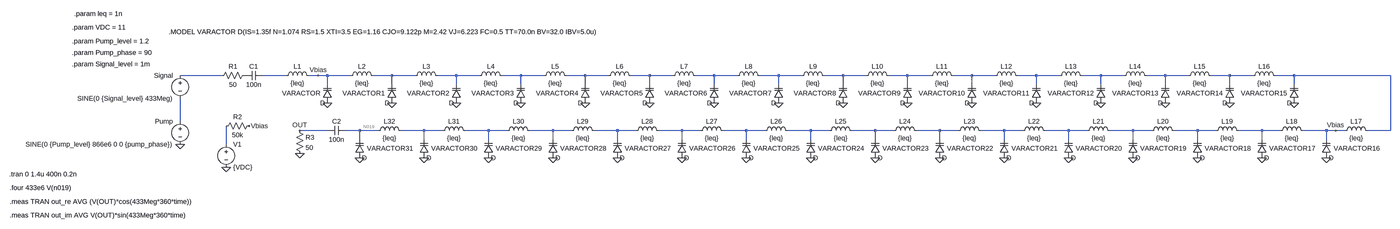
[diagram p0: schematic Parametric_amplifier_first_iteration(probaly not working properly).asc, whole sheet]
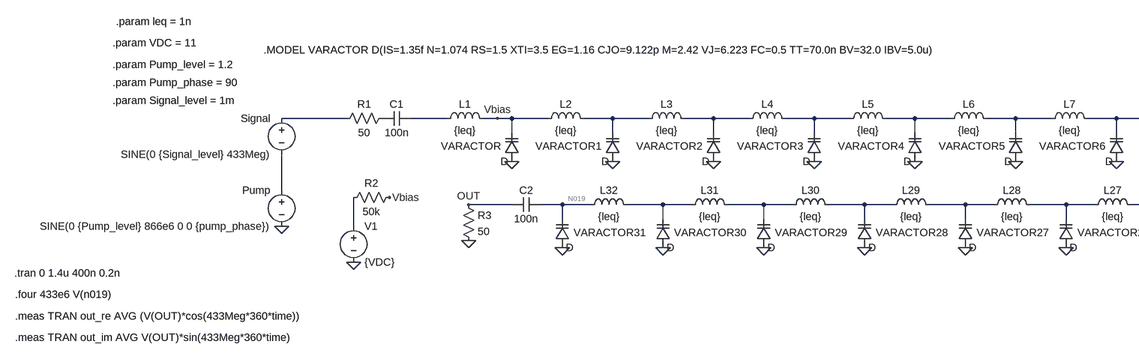
[diagram p1: schematic Parametric_amplifier_first_iteration(probaly not working properly).asc, part, row 1 of 1, column 1 of 2]
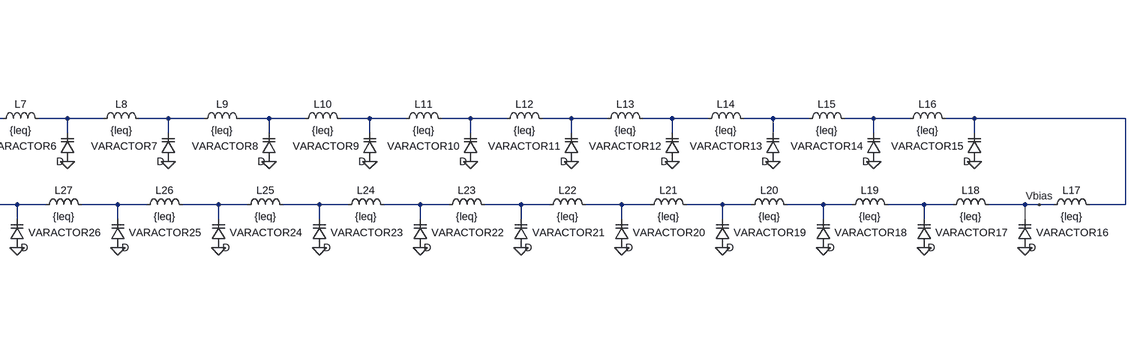
[diagram p2: schematic Parametric_amplifier_first_iteration(probaly not working properly).asc, part, row 1 of 1, column 2 of 2]
Parametric_amplifier_first_iteration(probaly not working properly).asc, the LTspice schematic file:
Version 4
SHEET 1 4228 728
WIRE 160 192 16 192
WIRE 384 192 304 192
WIRE 496 192 464 192
WIRE 528 192 496 192
WIRE 608 192 528 192
WIRE 752 192 688 192
WIRE 832 192 752 192
WIRE 976 192 912 192
WIRE 1056 192 976 192
WIRE 1200 192 1136 192
WIRE 1280 192 1200 192
WIRE 1424 192 1360 192
WIRE 1504 192 1424 192
WIRE 1648 192 1584 192
WIRE 1728 192 1648 192
WIRE 1872 192 1808 192
WIRE 1952 192 1872 192
WIRE 2096 192 2032 192
WIRE 2176 192 2096 192
WIRE 2320 192 2256 192
WIRE 2400 192 2320 192
WIRE 2544 192 2480 192
WIRE 2624 192 2544 192
WIRE 2768 192 2704 192
WIRE 2848 192 2768 192
WIRE 2992 192 2928 192
WIRE 3072 192 2992 192
WIRE 3216 192 3152 192
WIRE 3296 192 3216 192
WIRE 3440 192 3376 192
WIRE 3520 192 3440 192
WIRE 3664 192 3600 192
WIRE 3744 192 3664 192
WIRE 3888 192 3824 192
WIRE 4224 192 3888 192
WIRE 528 224 528 192
WIRE 752 224 752 192
WIRE 976 224 976 192
WIRE 1200 224 1200 192
WIRE 1424 224 1424 192
WIRE 1648 224 1648 192
WIRE 1872 224 1872 192
WIRE 2096 224 2096 192
WIRE 2320 224 2320 192
WIRE 2544 224 2544 192
WIRE 2768 224 2768 192
WIRE 2992 224 2992 192
WIRE 3216 224 3216 192
WIRE 3440 224 3440 192
WIRE 3664 224 3664 192
WIRE 3888 224 3888 192
WIRE 16 352 16 272
WIRE 528 384 432 384
WIRE 640 384 592 384
WIRE 704 384 640 384
WIRE 864 384 784 384
WIRE 928 384 864 384
WIRE 1088 384 1008 384
WIRE 1152 384 1088 384
WIRE 1312 384 1232 384
WIRE 1376 384 1312 384
WIRE 1536 384 1456 384
WIRE 1600 384 1536 384
WIRE 1760 384 1680 384
WIRE 1824 384 1760 384
WIRE 1984 384 1904 384
WIRE 2048 384 1984 384
WIRE 2208 384 2128 384
WIRE 2272 384 2208 384
WIRE 2432 384 2352 384
WIRE 2496 384 2432 384
WIRE 2656 384 2576 384
WIRE 2720 384 2656 384
WIRE 2880 384 2800 384
WIRE 2944 384 2880 384
WIRE 3104 384 3024 384
WIRE 3168 384 3104 384
WIRE 3328 384 3248 384
WIRE 3392 384 3328 384
WIRE 3552 384 3472 384
WIRE 3616 384 3552 384
WIRE 3776 384 3696 384
WIRE 3840 384 3776 384
WIRE 4000 384 3920 384
WIRE 4032 384 4000 384
WIRE 4064 384 4032 384
WIRE 4224 384 4224 192
WIRE 4224 384 4144 384
WIRE 640 416 640 384
WIRE 864 416 864 384
WIRE 1088 416 1088 384
WIRE 1312 416 1312 384
WIRE 1536 416 1536 384
WIRE 1760 416 1760 384
WIRE 1984 416 1984 384
WIRE 2208 416 2208 384
WIRE 2432 416 2432 384
WIRE 2656 416 2656 384
WIRE 2880 416 2880 384
WIRE 3104 416 3104 384
WIRE 3328 416 3328 384
WIRE 3552 416 3552 384
WIRE 3776 416 3776 384
WIRE 4000 416 4000 384
WIRE 176 432 176 368
FLAG 16 432 0
FLAG 528 288 0
FLAG 496 192 Vbias
FLAG 256 368 Vbias
FLAG 176 512 0
FLAG 752 288 0
FLAG 976 288 0
FLAG 1200 288 0
FLAG 1424 288 0
FLAG 1648 288 0
FLAG 1872 288 0
FLAG 2096 288 0
FLAG 2320 288 0
FLAG 2544 288 0
FLAG 2768 288 0
FLAG 2992 288 0
FLAG 3216 288 0
FLAG 3440 288 0
FLAG 3664 288 0
FLAG 3888 288 0
FLAG 4000 480 0
FLAG 4032 384 Vbias
FLAG 3776 480 0
FLAG 3552 480 0
FLAG 3328 480 0
FLAG 3104 480 0
FLAG 2880 480 0
FLAG 2656 480 0
FLAG 2432 480 0
FLAG 2208 480 0
FLAG 1984 480 0
FLAG 1760 480 0
FLAG 1536 480 0
FLAG 1312 480 0
FLAG 1088 480 0
FLAG 864 480 0
FLAG 640 480 0
FLAG 432 464 0
FLAG 432 384 OUT
SYMBOL voltage 16 176 M0
WINDOW 123 24 124 Left 2
WINDOW 39 0 0 Left 0
SYMATTR InstName Signal
SYMATTR Value SINE(0 {Signal_level} 433Meg)
SYMBOL voltage 16 336 M0
WINDOW 123 0 0 Left 0
WINDOW 39 0 0 Left 0
SYMATTR InstName Pump
SYMATTR Value SINE(0 {Pump_level} 866e6 0 0 {pump_phase})
SYMBOL varactor 544 288 R180
WINDOW 0 41 34 Left 2
WINDOW 3 24 0 Left 2
SYMATTR InstName VARACTOR
SYMBOL res 256 176 R90
WINDOW 0 0 56 VBottom 2
WINDOW 3 32 56 VTop 2
SYMATTR InstName R1
SYMATTR Value 50
SYMBOL cap 304 176 R90
WINDOW 0 0 32 VBottom 2
WINDOW 3 32 32 VTop 2
SYMATTR InstName C1
SYMATTR Value 100n
SYMBOL ind 368 208 R270
WINDOW 0 32 56 VTop 2
WINDOW 3 5 56 VBottom 2
SYMATTR InstName L1
SYMATTR Value {leq}
SYMBOL voltage 176 416 R0
WINDOW 123 0 0 Left 0
WINDOW 39 0 0 Left 0
SYMATTR InstName V1
SYMATTR Value {VDC}
SYMBOL res 272 352 R90
WINDOW 0 0 56 VBottom 2
WINDOW 3 32 56 VTop 2
SYMATTR InstName R2
SYMATTR Value 50k
SYMBOL varactor 768 288 R180
WINDOW 0 41 34 Left 2
WINDOW 3 24 0 Left 2
SYMATTR InstName VARACTOR1
SYMBOL ind 592 208 R270
WINDOW 0 32 56 VTop 2
WINDOW 3 5 56 VBottom 2
SYMATTR InstName L2
SYMATTR Value {leq}
SYMBOL varactor 992 288 R180
WINDOW 0 41 34 Left 2
WINDOW 3 24 0 Left 2
SYMATTR InstName VARACTOR2
SYMBOL ind 816 208 R270
WINDOW 0 32 56 VTop 2
WINDOW 3 5 56 VBottom 2
SYMATTR InstName L3
SYMATTR Value {leq}
SYMBOL varactor 1216 288 R180
WINDOW 0 41 34 Left 2
WINDOW 3 24 0 Left 2
SYMATTR InstName VARACTOR3
SYMBOL ind 1040 208 R270
WINDOW 0 32 56 VTop 2
WINDOW 3 5 56 VBottom 2
SYMATTR InstName L4
SYMATTR Value {leq}
SYMBOL varactor 1440 288 R180
WINDOW 0 41 34 Left 2
WINDOW 3 24 0 Left 2
SYMATTR InstName VARACTOR4
SYMBOL ind 1264 208 R270
WINDOW 0 32 56 VTop 2
WINDOW 3 5 56 VBottom 2
SYMATTR InstName L5
SYMATTR Value {leq}
SYMBOL varactor 1664 288 R180
WINDOW 0 41 34 Left 2
WINDOW 3 24 0 Left 2
SYMATTR InstName VARACTOR5
SYMBOL ind 1488 208 R270
WINDOW 0 32 56 VTop 2
WINDOW 3 5 56 VBottom 2
SYMATTR InstName L6
SYMATTR Value {leq}
SYMBOL varactor 1888 288 R180
WINDOW 0 41 34 Left 2
WINDOW 3 24 0 Left 2
SYMATTR InstName VARACTOR6
SYMBOL ind 1712 208 R270
WINDOW 0 32 56 VTop 2
WINDOW 3 5 56 VBottom 2
SYMATTR InstName L7
SYMATTR Value {leq}
SYMBOL varactor 2112 288 R180
WINDOW 0 41 34 Left 2
WINDOW 3 24 0 Left 2
SYMATTR InstName VARACTOR7
SYMBOL ind 1936 208 R270
WINDOW 0 32 56 VTop 2
WINDOW 3 5 56 VBottom 2
SYMATTR InstName L8
SYMATTR Value {leq}
SYMBOL varactor 2336 288 R180
WINDOW 0 41 34 Left 2
WINDOW 3 24 0 Left 2
SYMATTR InstName VARACTOR8
SYMBOL ind 2160 208 R270
WINDOW 0 32 56 VTop 2
WINDOW 3 5 56 VBottom 2
SYMATTR InstName L9
SYMATTR Value {leq}
SYMBOL varactor 2560 288 R180
WINDOW 0 41 34 Left 2
WINDOW 3 24 0 Left 2
SYMATTR InstName VARACTOR9
SYMBOL ind 2384 208 R270
WINDOW 0 32 56 VTop 2
WINDOW 3 5 56 VBottom 2
SYMATTR InstName L10
SYMATTR Value {leq}
SYMBOL varactor 2784 288 R180
WINDOW 0 41 34 Left 2
WINDOW 3 24 0 Left 2
SYMATTR InstName VARACTOR10
SYMBOL ind 2608 208 R270
WINDOW 0 32 56 VTop 2
WINDOW 3 5 56 VBottom 2
SYMATTR InstName L11
SYMATTR Value {leq}
SYMBOL varactor 3008 288 R180
WINDOW 0 41 34 Left 2
WINDOW 3 24 0 Left 2
SYMATTR InstName VARACTOR11
SYMBOL ind 2832 208 R270
WINDOW 0 32 56 VTop 2
WINDOW 3 5 56 VBottom 2
SYMATTR InstName L12
SYMATTR Value {leq}
SYMBOL varactor 3232 288 R180
WINDOW 0 41 34 Left 2
WINDOW 3 24 0 Left 2
SYMATTR InstName VARACTOR12
SYMBOL ind 3056 208 R270
WINDOW 0 32 56 VTop 2
WINDOW 3 5 56 VBottom 2
SYMATTR InstName L13
SYMATTR Value {leq}
SYMBOL varactor 3456 288 R180
WINDOW 0 41 34 Left 2
WINDOW 3 24 0 Left 2
SYMATTR InstName VARACTOR13
SYMBOL ind 3280 208 R270
WINDOW 0 32 56 VTop 2
WINDOW 3 5 56 VBottom 2
SYMATTR InstName L14
SYMATTR Value {leq}
SYMBOL varactor 3680 288 R180
WINDOW 0 41 34 Left 2
WINDOW 3 24 0 Left 2
SYMATTR InstName VARACTOR14
SYMBOL ind 3504 208 R270
WINDOW 0 32 56 VTop 2
WINDOW 3 5 56 VBottom 2
SYMATTR InstName L15
SYMATTR Value {leq}
SYMBOL varactor 3904 288 R180
WINDOW 0 41 34 Left 2
WINDOW 3 24 0 Left 2
SYMATTR InstName VARACTOR15
SYMBOL ind 3728 208 R270
WINDOW 0 32 56 VTop 2
WINDOW 3 5 56 VBottom 2
SYMATTR InstName L16
SYMATTR Value {leq}
SYMBOL varactor 3984 480 M180
WINDOW 0 41 34 Left 2
WINDOW 3 24 0 Left 2
SYMATTR InstName VARACTOR16
SYMBOL ind 4160 400 M270
WINDOW 0 32 56 VTop 2
WINDOW 3 5 56 VBottom 2
SYMATTR InstName L17
SYMATTR Value {leq}
SYMBOL varactor 3760 480 M180
WINDOW 0 41 34 Left 2
WINDOW 3 24 0 Left 2
SYMATTR InstName VARACTOR17
SYMBOL ind 3936 400 M270
WINDOW 0 32 56 VTop 2
WINDOW 3 5 56 VBottom 2
SYMATTR InstName L18
SYMATTR Value {leq}
SYMBOL varactor 3536 480 M180
WINDOW 0 41 34 Left 2
WINDOW 3 24 0 Left 2
SYMATTR InstName VARACTOR18
SYMBOL ind 3712 400 M270
WINDOW 0 32 56 VTop 2
WINDOW 3 5 56 VBottom 2
SYMATTR InstName L19
SYMATTR Value {leq}
SYMBOL varactor 3312 480 M180
WINDOW 0 41 34 Left 2
WINDOW 3 24 0 Left 2
SYMATTR InstName VARACTOR19
SYMBOL ind 3488 400 M270
WINDOW 0 32 56 VTop 2
WINDOW 3 5 56 VBottom 2
SYMATTR InstName L20
SYMATTR Value {leq}
SYMBOL varactor 3088 480 M180
WINDOW 0 41 34 Left 2
WINDOW 3 24 0 Left 2
SYMATTR InstName VARACTOR20
SYMBOL ind 3264 400 M270
WINDOW 0 32 56 VTop 2
WINDOW 3 5 56 VBottom 2
SYMATTR InstName L21
SYMATTR Value {leq}
SYMBOL varactor 2864 480 M180
WINDOW 0 41 34 Left 2
WINDOW 3 24 0 Left 2
SYMATTR InstName VARACTOR21
SYMBOL ind 3040 400 M270
WINDOW 0 32 56 VTop 2
WINDOW 3 5 56 VBottom 2
SYMATTR InstName L22
SYMATTR Value {leq}
SYMBOL varactor 2640 480 M180
WINDOW 0 41 34 Left 2
WINDOW 3 24 0 Left 2
SYMATTR InstName VARACTOR22
SYMBOL ind 2816 400 M270
WINDOW 0 32 56 VTop 2
WINDOW 3 5 56 VBottom 2
SYMATTR InstName L23
SYMATTR Value {leq}
SYMBOL varactor 2416 480 M180
WINDOW 0 41 34 Left 2
WINDOW 3 24 0 Left 2
SYMATTR InstName VARACTOR23
SYMBOL ind 2592 400 M270
WINDOW 0 32 56 VTop 2
WINDOW 3 5 56 VBottom 2
SYMATTR InstName L24
SYMATTR Value {leq}
SYMBOL varactor 2192 480 M180
WINDOW 0 41 34 Left 2
WINDOW 3 24 0 Left 2
SYMATTR InstName VARACTOR24
SYMBOL ind 2368 400 M270
WINDOW 0 32 56 VTop 2
WINDOW 3 5 56 VBottom 2
SYMATTR InstName L25
SYMATTR Value {leq}
SYMBOL varactor 1968 480 M180
WINDOW 0 41 34 Left 2
WINDOW 3 24 0 Left 2
SYMATTR InstName VARACTOR25
SYMBOL ind 2144 400 M270
WINDOW 0 32 56 VTop 2
WINDOW 3 5 56 VBottom 2
SYMATTR InstName L26
SYMATTR Value {leq}
SYMBOL varactor 1744 480 M180
WINDOW 0 41 34 Left 2
WINDOW 3 24 0 Left 2
SYMATTR InstName VARACTOR26
SYMBOL ind 1920 400 M270
WINDOW 0 32 56 VTop 2
WINDOW 3 5 56 VBottom 2
SYMATTR InstName L27
SYMATTR Value {leq}
SYMBOL varactor 1520 480 M180
WINDOW 0 41 34 Left 2
WINDOW 3 24 0 Left 2
SYMATTR InstName VARACTOR27
SYMBOL ind 1696 400 M270
WINDOW 0 32 56 VTop 2
WINDOW 3 5 56 VBottom 2
SYMATTR InstName L28
SYMATTR Value {leq}
SYMBOL varactor 1296 480 M180
WINDOW 0 41 34 Left 2
WINDOW 3 24 0 Left 2
SYMATTR InstName VARACTOR28
SYMBOL ind 1472 400 M270
WINDOW 0 32 56 VTop 2
WINDOW 3 5 56 VBottom 2
SYMATTR InstName L29
SYMATTR Value {leq}
SYMBOL varactor 1072 480 M180
WINDOW 0 41 34 Left 2
WINDOW 3 24 0 Left 2
SYMATTR InstName VARACTOR29
SYMBOL ind 1248 400 M270
WINDOW 0 32 56 VTop 2
WINDOW 3 5 56 VBottom 2
SYMATTR InstName L30
SYMATTR Value {leq}
SYMBOL varactor 848 480 M180
WINDOW 0 41 34 Left 2
WINDOW 3 24 0 Left 2
SYMATTR InstName VARACTOR30
SYMBOL ind 1024 400 M270
WINDOW 0 32 56 VTop 2
WINDOW 3 5 56 VBottom 2
SYMATTR InstName L31
SYMATTR Value {leq}
SYMBOL varactor 624 480 M180
WINDOW 0 41 34 Left 2
WINDOW 3 24 0 Left 2
SYMATTR InstName VARACTOR31
SYMBOL ind 800 400 M270
WINDOW 0 32 56 VTop 2
WINDOW 3 5 56 VBottom 2
SYMATTR InstName L32
SYMATTR Value {leq}
SYMBOL res 416 368 R0
SYMATTR InstName R3
SYMATTR Value 50
SYMBOL cap 592 368 R90
WINDOW 0 0 32 VBottom 2
WINDOW 3 32 32 VTop 2
SYMATTR InstName C2
SYMATTR Value 100n
TEXT -24 40 Left 2 !.MODEL VARACTOR D(IS=1.35f N=1.074 RS=1.5 XTI=3.5 EG=1.16 CJO=9.122p M=2.42 VJ=6.223 FC=0.5 TT=70.0n BV=32.0 IBV=5.0u)
TEXT -352 -24 Left 2 !.param leq = 1n
TEXT -360 24 Left 2 !.param VDC = 11
TEXT -360 72 Left 2 !.param Pump_level = 1.2
TEXT -360 112 Left 2 !.param Pump_phase = 90
TEXT -360 152 Left 2 !.param Signal_level = 1m
TEXT -578 536 Left 2 !.tran 0 1.4u 400n 0.2n
TEXT -576 584 Left 2 !.four 433e6 V(n019)
TEXT -576 632 Left 2 !.meas TRAN out_re AVG (V(OUT)*cos(433Meg*360*time))
TEXT -576 680 Left 2 !.meas TRAN out_im AVG V(OUT)*sin(433Meg*360*time)

The netlist it stands for:
* Parametric_amplifier_first_iteration(probaly not working properly).asc
V§Signal N001 N018 SINE(0 {Signal_level} 433Meg)
V§Pump N018 0 SINE(0 {Pump_level} 866e6 0 0 {pump_phase})
D§VARACTOR 0 Vbias D
R1 P001 N001 50
C1 N002 P001 100n
L1 N002 Vbias {leq}
V1 N034 0 {VDC}
R2 Vbias N034 50k
D§VARACTOR1 0 N003 D
L2 Vbias N003 {leq}
D§VARACTOR2 0 N004 D
L3 N003 N004 {leq}
D§VARACTOR3 0 N005 D
L4 N004 N005 {leq}
D§VARACTOR4 0 N006 D
L5 N005 N006 {leq}
D§VARACTOR5 0 N007 D
L6 N006 N007 {leq}
D§VARACTOR6 0 N008 D
L7 N007 N008 {leq}
D§VARACTOR7 0 N009 D
L8 N008 N009 {leq}
D§VARACTOR8 0 N010 D
L9 N009 N010 {leq}
D§VARACTOR9 0 N011 D
L10 N010 N011 {leq}
D§VARACTOR10 0 N012 D
L11 N011 N012 {leq}
D§VARACTOR11 0 N013 D
L12 N012 N013 {leq}
D§VARACTOR12 0 N014 D
L13 N013 N014 {leq}
D§VARACTOR13 0 N015 D
L14 N014 N015 {leq}
D§VARACTOR14 0 N016 D
L15 N015 N016 {leq}
D§VARACTOR15 0 N017 D
L16 N016 N017 {leq}
D§VARACTOR16 0 Vbias D
L17 N017 Vbias {leq}
D§VARACTOR17 0 N033 D
L18 Vbias N033 {leq}
D§VARACTOR18 0 N032 D
L19 N033 N032 {leq}
D§VARACTOR19 0 N031 D
L20 N032 N031 {leq}
D§VARACTOR20 0 N030 D
L21 N031 N030 {leq}
D§VARACTOR21 0 N029 D
L22 N030 N029 {leq}
D§VARACTOR22 0 N028 D
L23 N029 N028 {leq}
D§VARACTOR23 0 N027 D
L24 N028 N027 {leq}
D§VARACTOR24 0 N026 D
L25 N027 N026 {leq}
D§VARACTOR25 0 N025 D
L26 N026 N025 {leq}
D§VARACTOR26 0 N024 D
L27 N025 N024 {leq}
D§VARACTOR27 0 N023 D
L28 N024 N023 {leq}
D§VARACTOR28 0 N022 D
L29 N023 N022 {leq}
D§VARACTOR29 0 N021 D
L30 N022 N021 {leq}
D§VARACTOR30 0 N020 D
L31 N021 N020 {leq}
D§VARACTOR31 0 N019 D
L32 N020 N019 {leq}
R3 OUT 0 50
C2 N019 OUT 100n
.model D D
.lib standard.dio
.MODEL VARACTOR D(IS=1.35f N=1.074 RS=1.5 XTI=3.5 EG=1.16 CJO=9.122p M=2.42 VJ=6.223 FC=0.5 TT=70.0n BV=32.0 IBV=5.0u)
.param leq = 1n
.param VDC = 11
.param Pump_level = 1.2
.param Pump_phase = 90
.param Signal_level = 1m
.tran 0 1.4u 400n 0.2n
.four 433e6 V(n019)
.meas TRAN out_re AVG (V(OUT)*cos(433Meg*360*time))
.meas TRAN out_im AVG V(OUT)*sin(433Meg*360*time)
.backanno
.end